# EAGLE schematic h bridge (EAGLE 7.7.0)
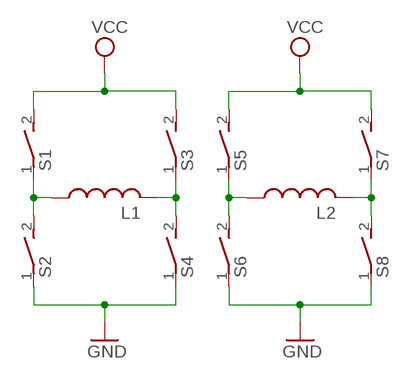
[diagram p0: schematic, sheet 1]

## Parts
L1  L-US0204/5  [0204/5]
L2  L-US0204/5  [0204/5]
S1  DS01E  [DS-01]
S2  DS01E  [DS-01]
S3  DS01E  [DS-01]
S4  DS01E  [DS-01]
S5  DS01E  [DS-01]
S6  DS01E  [DS-01]
S7  DS01E  [DS-01]
S8  DS01E  [DS-01]

## Nets
GND: S2.1 S4.1 S6.1 S8.1
N$1: L1.1 S1.1 S2.2
N$2: L1.2 S3.1 S4.2
N$3: L2.1 S5.1 S6.2
N$4: L2.2 S7.1 S8.2
VCC: S1.2 S3.2 S5.2 S7.2

## Library data of the parts
L1 L2 = resistor:L-US: INDUCTOR, American symbol
S1-S8 = switch-dil:DS01E: DIL/CODE SWITCH; OC_FARNELL: unknown; OC_NEWARK: unknown